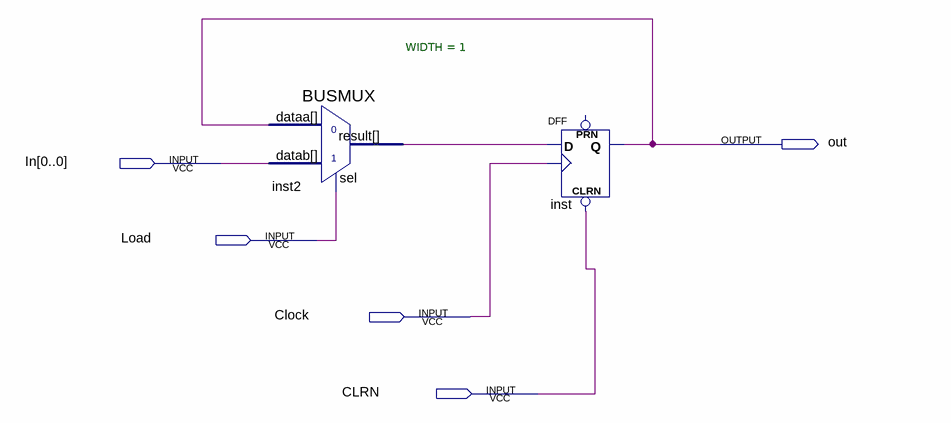
[diagram p0: schematic sheet]
// Quartus schematic lab12step1.bdf as structural Verilog: 2 symbols, 5 pins
module lab12step1 (
  input  [0:0] In,
  input  Load,
  input  Clock,
  input  CLRN,
  output out
);

  wire inst2_result;

  BUSMUX #(.WIDTH(1)) inst2 (.datab(In[0]), .sel(Load), .dataa(out), .result(inst2_result));
  DFF inst (.CLRN(CLRN), .CLK(Clock), .D(inst2_result), .Q(out));  // open: PRN
endmodule
